# Altium schematic sheet Button-LED.SchDoc: =ProjectTitle
size 297 x 209 mm; Address1: Address1; Address2: Address2; Address3: Address3; Address4: Address4; SheetNumber: 6; SheetTotal: 7; Scale: 1:1; DocumentType: Схема электрическая принципиальная
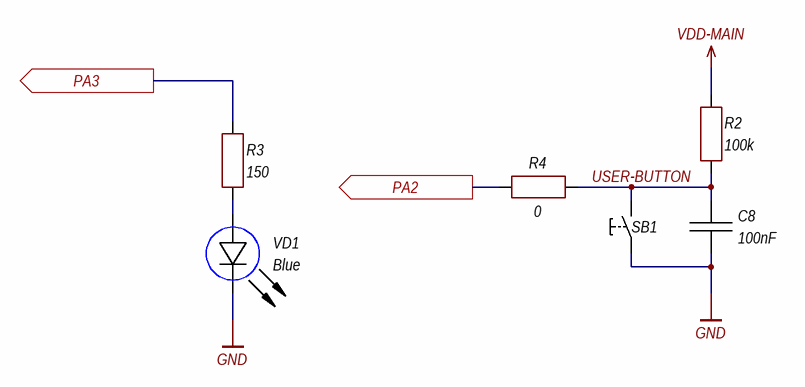
[diagram p0: Button-LED.SchDoc]

## Parts
C8  100nF  [CH0402C]
R2  100k  [CH0402R]
R3  150  [CH0402R]
R4  0  [CH0402R]
SB1  "Кнопка"  [BUT: YTS-A017]  (value not drawn)
VD1  Blue  [CH0402LG]

## Ports
PA2 (out), PA3 (out)

## Nets
GND: C8.1 SB1.1 VD1.2(C)
VDD-MAIN: R2.2
PA2: R4.1 ; port PA2
PA3: R3.2 ; port PA3
USER-BUTTON: C8.2 R2.1 R4.2 SB1.2
NetR3_1: R3.1 VD1.1(A)

## Notes on the sheet
- Изм.
- Лист
- № докум.
- Подп.
- Дата
- Копировал
- Формат А4

## Library data of the parts
C8 = Capacitor: Manufacturer: *; Model: *; HelpURL: *; ComponentKind: *; Value: 100nF
R2-R4 = Resistor: Manufacturer: *; Model: *; HelpURL: *; ComponentKind: *
  R2: Value: 100k
  R3: Value: 150
  R4: Value: 0
SB1 = 1-Button: Button, no latching; Manufacturer: *; Model: *; HelpURL: *; ComponentKind: *
VD1 = LED: Manufacturer: *; Model: *; HelpURL: *; ComponentKind: *; Value: Blue